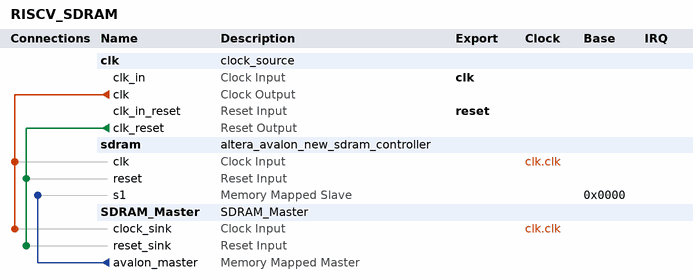
[diagram p0: system contents]
# Platform Designer (Qsys) system RISCV_SDRAM, Cyclone II EP2C70F896C6
# Parameters at their usual value, and those the tool derives, are not listed.
package require -exact qsys 13.0
create_system RISCV_SDRAM
set_project_property DEVICE_FAMILY {Cyclone II}
set_project_property DEVICE EP2C70F896C6

add_instance clk clock_source 13.0
set_instance_parameter_value clk clockFrequency 50000000

add_instance sdram altera_avalon_new_sdram_controller 13.0.1.99.2
set_instance_parameter_value sdram TAC 5.5
set_instance_parameter_value sdram TRCD 20.0
set_instance_parameter_value sdram TRP 20.0
set_instance_parameter_value sdram casLatency 3
set_instance_parameter_value sdram columnWidth 8
set_instance_parameter_value sdram dataWidth 32
set_instance_parameter_value sdram generateSimulationModel false
set_instance_parameter_value sdram model single_Micron_MT48LC4M32B2_7_chip
set_instance_parameter_value sdram numberOfBanks 2
set_instance_parameter_value sdram numberOfChipSelects 1
set_instance_parameter_value sdram powerUpDelay 100.0
set_instance_parameter_value sdram refreshPeriod 15.625
set_instance_parameter_value sdram rowWidth 11

add_instance SDRAM_Master SDRAM_Master 1.0

# connections
add_connection clk.clk sdram.clk clock
add_connection clk.clk SDRAM_Master.clock_sink clock
add_connection clk.clk_reset sdram.reset reset
add_connection clk.clk_reset SDRAM_Master.reset_sink reset
add_connection SDRAM_Master.avalon_master sdram.s1 avalon
set_connection_parameter_value SDRAM_Master.avalon_master/sdram.s1 baseAddress 0x0000

# exported interfaces
add_interface clk clock sink
set_interface_property clk EXPORT_OF clk.clk_in
add_interface reset reset sink
set_interface_property reset EXPORT_OF clk.clk_in_reset

set_interconnect_requirement {$system} qsys_mm.clockCrossingAdapter HANDSHAKE
set_interconnect_requirement {$system} qsys_mm.maxAdditionalLatency 1

save_system RISCV_SDRAM.qsys
